# Altium project DM1090FFC_R3M0E3.PrjPcb (part 2 of 4)

## Sheet DM1090FFC_MIPI_CAM.SchDoc: =project_title
size Tabloid; PageSetup: Record=PageOptions|CenterHorizontal=True|CenterVertical=True|PrintScale=0.73|XCorrection=1.00|YCorrection=1.00|PrintKind=0|BorderSize=5000000|LeftOffset=0|BottomOffset=0|Orientation=2|PaperLength=1000|PaperWidth=1000|Scale=100|PaperSource=7|PrintQuality=-4|MediaType=1|DitherType=10|PaperKind=A4|PrintScaleMode=1; CompanyName: Luxonis Holding; DrawnBy: David Malovrh; Organization: Luxonis Holding; Address1: 1925 Harmony Park Drive; Address2: Westminster, CO; Address3: 80234; Address4: United States; DocumentNumber: DXXXX; Revision: R3M0E3; SheetNumber: 4; SheetTotal: 5
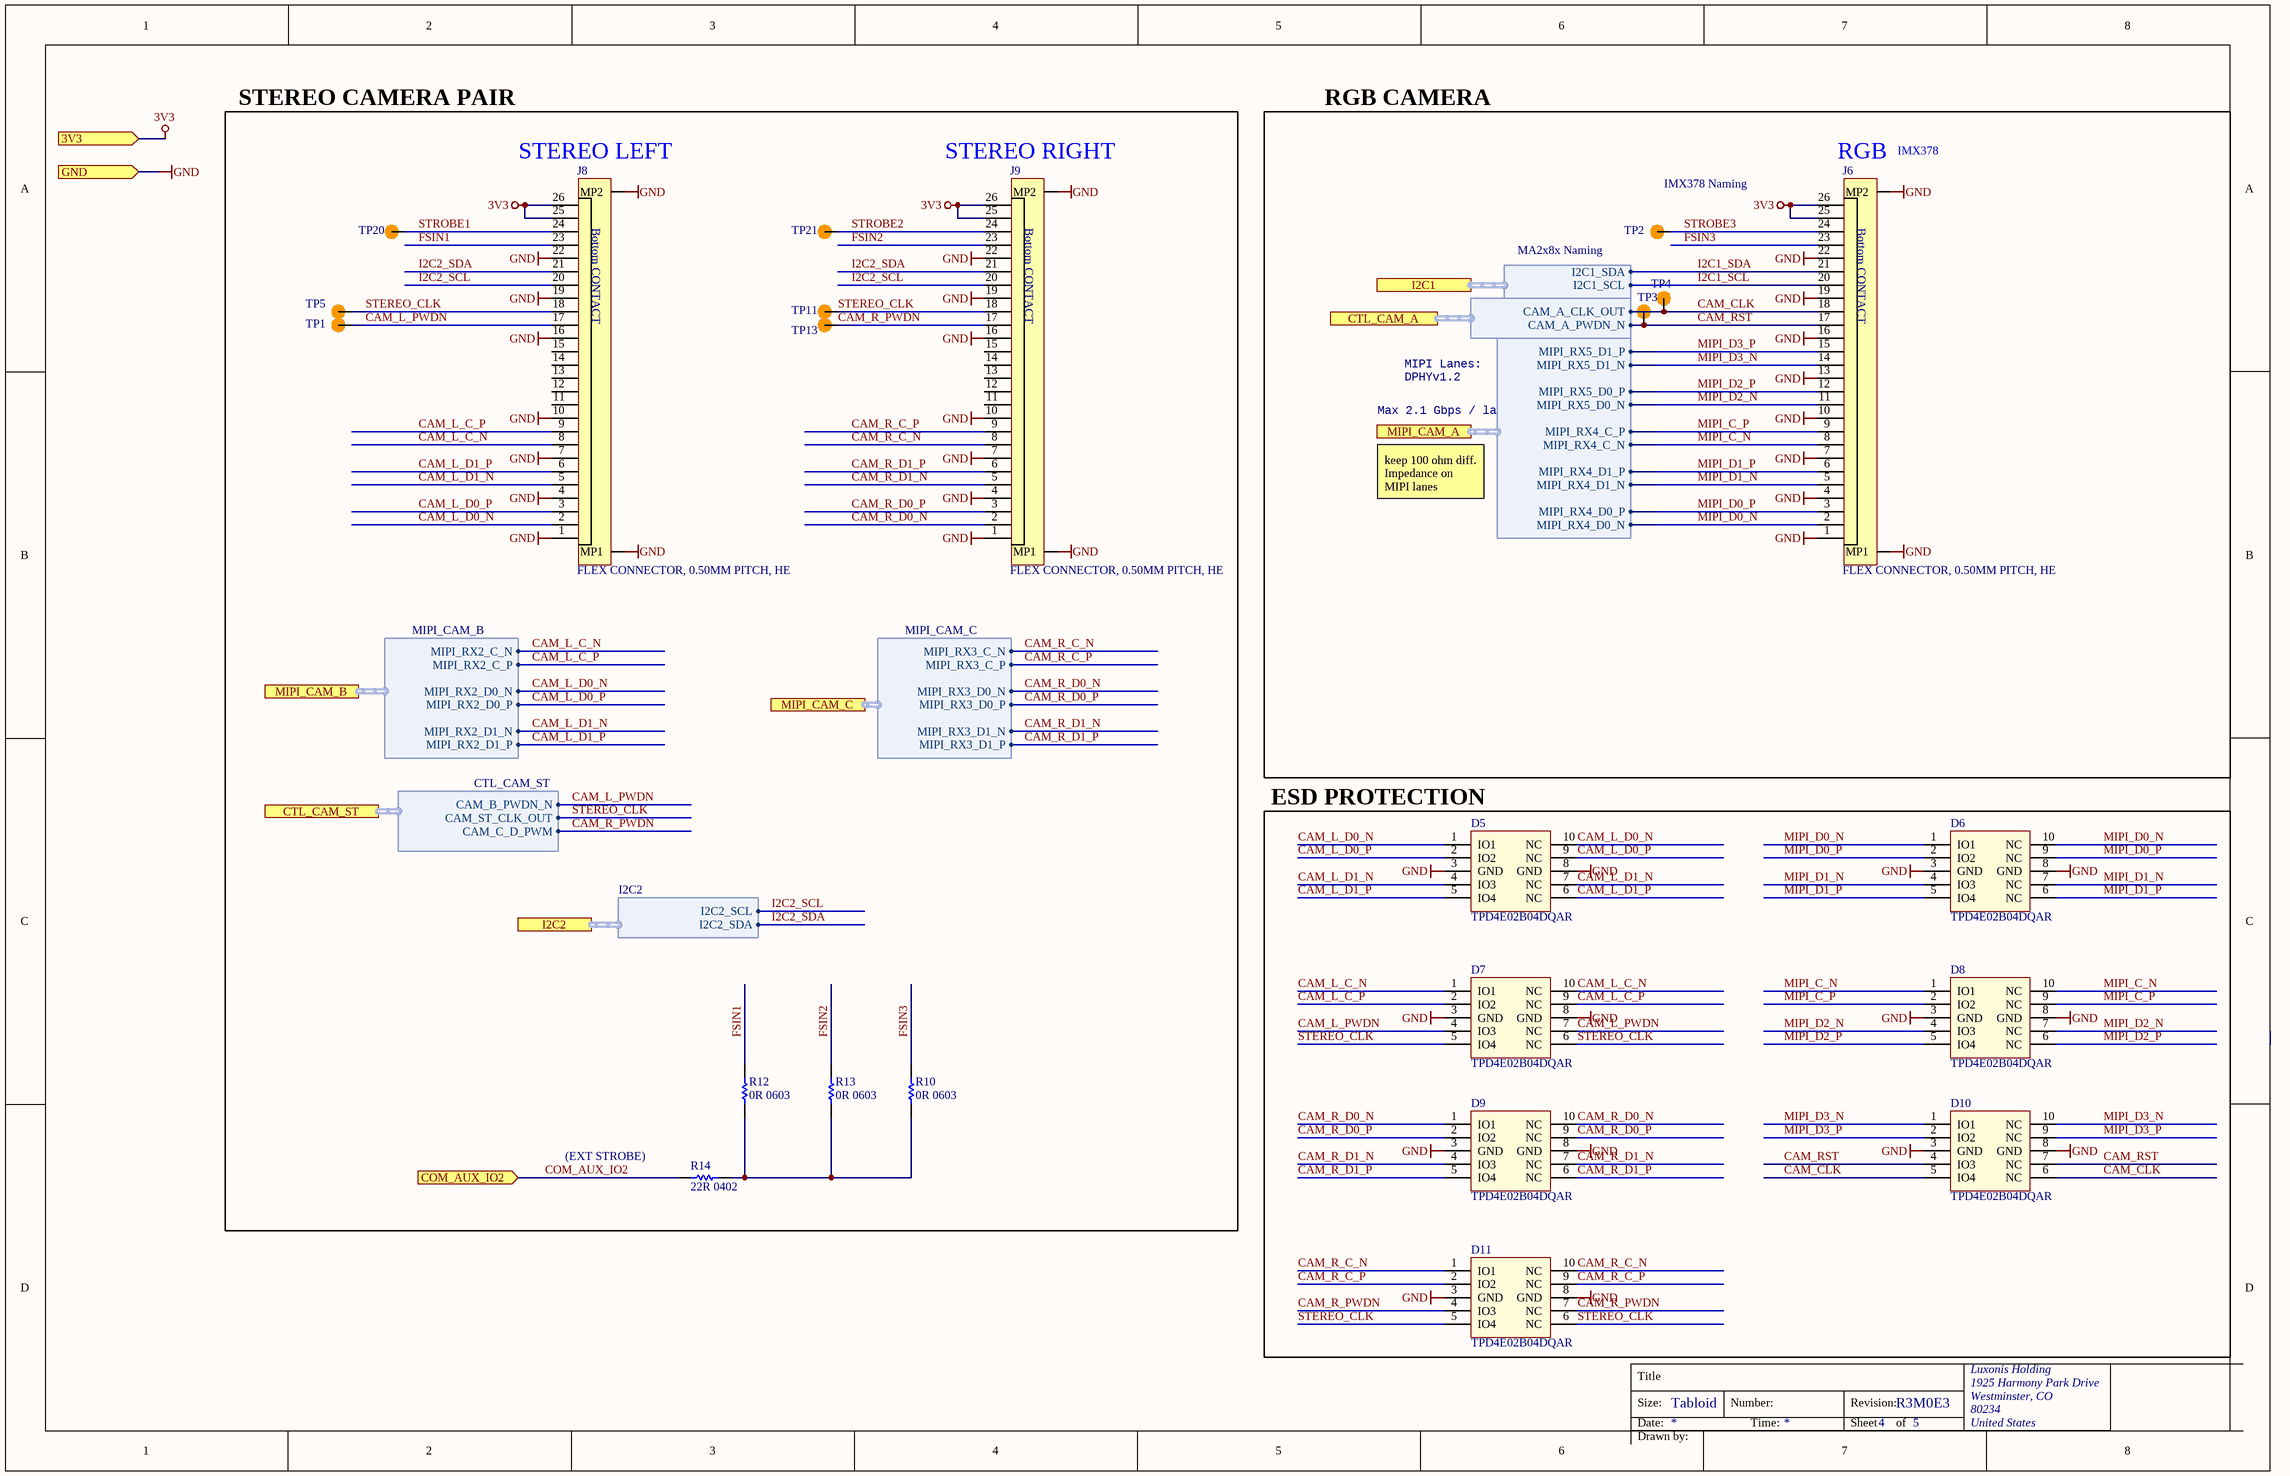
[diagram p3: DM1090FFC_MIPI_CAM.SchDoc]

### Parts
D5  TPD4E02B04DQAR  [TPD4E02B04DQAR]
D6  TPD4E02B04DQAR  [TPD4E02B04DQAR]
D7  TPD4E02B04DQAR  [TPD4E02B04DQAR]
D8  TPD4E02B04DQAR  [TPD4E02B04DQAR]
D9  TPD4E02B04DQAR  [TPD4E02B04DQAR]
D10  TPD4E02B04DQAR  [TPD4E02B04DQAR]
D11  TPD4E02B04DQAR  [TPD4E02B04DQAR]
J6  FLEX CONNECTOR, 0.50MM PITCH, HE  [F32R-1A7H1-11026]
J8  FLEX CONNECTOR, 0.50MM PITCH, HE  [F32R-1A7H1-11026]
J9  FLEX CONNECTOR, 0.50MM PITCH, HE  [F32R-1A7H1-11026]
R10  0R 0603  [RESC0603(1608)_N]
R12  0R 0603  [RESC0603(1608)_N]
R13  0R 0603  [RESC0603(1608)_N]
R14  22R 0402  [RESC0402(1005)_N]
TP1  TP100_200_NS  [TP100_200_NS]  (value not drawn)  (no BOM)
TP2  TP100_200_NS  [TP100_200_NS]  (value not drawn)  (no BOM)
TP3  TP100_200_NS  [TP100_200_NS]  (value not drawn)  (no BOM)
TP4  TP100_200_NS  [TP100_200_NS]  (value not drawn)  (no BOM)
TP5  TP100_200_NS  [TP100_200_NS]  (value not drawn)  (no BOM)
TP11  TP100_200_NS  [TP100_200_NS]  (value not drawn)  (no BOM)
TP13  TP100_200_NS  [TP100_200_NS]  (value not drawn)  (no BOM)
TP20  TP100_200_NS  [TP100_200_NS]  (value not drawn)  (no BOM)
TP21  TP100_200_NS  [TP100_200_NS]  (value not drawn)  (no BOM)

### Blocks framed on the sheet
ESD PROTECTION: D5-D11

### Ports
3V3 (in), COM_AUX_IO2 (in), CTL_CAM_A (harness CTL_CAM_A), CTL_CAM_ST (harness CTL_CAM_ST), GND (in), I2C1 (harness I2C1), I2C2 (harness I2C2), MIPI_CAM_A (harness MIPI_CAM_A), MIPI_CAM_B (harness MIPI_CAM_B), MIPI_CAM_C (harness MIPI_CAM_C)

### Harnesses
MIPI_CAM_B: MIPI_RX2_C_P, MIPI_RX2_C_N, MIPI_RX2_D0_P, MIPI_RX2_D0_N, MIPI_RX2_D1_P, MIPI_RX2_D1_N
I2C2: I2C2_SDA, I2C2_SCL
I2C1: I2C1_SDA, I2C1_SCL
MIPI_CAM_A: MIPI_RX5_D0_P, MIPI_RX5_D0_N, MIPI_RX4_D0_P, MIPI_RX4_D0_N, MIPI_RX4_C_P, MIPI_RX4_C_N, MIPI_RX4_D1_N, MIPI_RX4_D1_P, MIPI_RX5_D1_P, MIPI_RX5_D1_N
MIPI_CAM_C: MIPI_RX3_C_P, MIPI_RX3_C_N, MIPI_RX3_D0_P, MIPI_RX3_D0_N, MIPI_RX3_D1_P, MIPI_RX3_D1_N
CTL_CAM_A: CAM_A_PWDN_N, CAM_A_CLK_OUT
CTL_CAM_ST: CAM_ST_CLK_OUT, CAM_B_PWDN_N, CAM_C_D_PWM

### Nets
3V3: J6.25 J6.26 J8.25 J8.26 J9.25 J9.26 ; port 3V3
GND: D5.3(GND) D5.8(GND) D6.3(GND) D6.8(GND) D7.3(GND) D7.8(GND) D8.3(GND) D8.8(GND) D9.3(GND) D9.8(GND) D10.3(GND) D10.8(GND) D11.3(GND) D11.8(GND) J6.1 J6.4 J6.7 J6.10 J6.13 J6.16 J6.19 J6.22 J6.MP1 J6.MP2 J8.1 J8.4 J8.7 J8.10 J8.16 J8.19 J8.22 J8.MP1 J8.MP2 J9.1 J9.4 J9.7 J9.10 J9.16 J9.19 J9.22 J9.MP1 J9.MP2 ; port GND
CAM_CLK: D10.5(IO4) D10.6(NC) J6.18 TP4.1 ; port CTL_CAM_A.CAM_A_CLK_OUT  [project net CAM_A_CLK_OUT]
CAM_L_C_N: D7.1(IO1) D7.10(NC) J8.8 ; port MIPI_CAM_B.MIPI_RX2_C_N
CAM_L_C_P: D7.2(IO2) D7.9(NC) J8.9 ; port MIPI_CAM_B.MIPI_RX2_C_P
CAM_L_D0_N: D5.1(IO1) D5.10(NC) J8.2 ; port MIPI_CAM_B.MIPI_RX2_D0_N
CAM_L_D0_P: D5.2(IO2) D5.9(NC) J8.3 ; port MIPI_CAM_B.MIPI_RX2_D0_P
CAM_L_D1_N: D5.4(IO3) D5.7(NC) J8.5 ; port MIPI_CAM_B.MIPI_RX2_D1_N
CAM_L_D1_P: D5.5(IO4) D5.6(NC) J8.6 ; port MIPI_CAM_B.MIPI_RX2_D1_P
CAM_L_PWDN: D7.4(IO3) D7.7(NC) J8.17 TP1.1 ; port CTL_CAM_ST.CAM_B_PWDN_N  [project net CAM_B_PWDN_N]
CAM_R_C_N: D11.1(IO1) D11.10(NC) J9.8 ; port MIPI_CAM_C.MIPI_RX3_C_N
CAM_R_C_P: D11.2(IO2) D11.9(NC) J9.9 ; port MIPI_CAM_C.MIPI_RX3_C_P
CAM_R_D0_N: D9.1(IO1) D9.10(NC) J9.2 ; port MIPI_CAM_C.MIPI_RX3_D0_N
CAM_R_D0_P: D9.2(IO2) D9.9(NC) J9.3 ; port MIPI_CAM_C.MIPI_RX3_D0_P
CAM_R_D1_N: D9.4(IO3) D9.7(NC) J9.5 ; port MIPI_CAM_C.MIPI_RX3_D1_N
CAM_R_D1_P: D9.5(IO4) D9.6(NC) J9.6 ; port MIPI_CAM_C.MIPI_RX3_D1_P
CAM_R_PWDN: D11.4(IO3) D11.7(NC) J9.17 TP13.1 ; port CTL_CAM_ST.CAM_C_D_PWM  [project net CAM_C_D_PWM]
CAM_RST: D10.4(IO3) D10.7(NC) J6.17 TP3.1 ; port CTL_CAM_A.CAM_A_PWDN_N  [project net CAM_A_PWDN_N]
COM_AUX_IO2: R14.1 ; port COM_AUX_IO2
FSIN1: J8.23 R12.2
FSIN2: J9.23 R13.2
FSIN3: J6.23 R10.2
I2C1_SCL: J6.20 ; port I2C1.I2C1_SCL
I2C1_SDA: J6.21 ; port I2C1.I2C1_SDA
I2C2_SCL: J8.20 J9.20 ; port I2C2.I2C2_SCL
I2C2_SDA: J8.21 J9.21 ; port I2C2.I2C2_SDA
MIPI_C_N: D8.1(IO1) D8.10(NC) J6.8 ; port MIPI_CAM_A.MIPI_RX4_C_N
MIPI_C_P: D8.2(IO2) D8.9(NC) J6.9 ; port MIPI_CAM_A.MIPI_RX4_C_P
MIPI_D0_N: D6.1(IO1) D6.10(NC) J6.2 ; port MIPI_CAM_A.MIPI_RX4_D0_N
MIPI_D0_P: D6.2(IO2) D6.9(NC) J6.3 ; port MIPI_CAM_A.MIPI_RX4_D0_P
MIPI_D1_N: D6.4(IO3) D6.7(NC) J6.5 ; port MIPI_CAM_A.MIPI_RX4_D1_N
MIPI_D1_P: D6.5(IO4) D6.6(NC) J6.6 ; port MIPI_CAM_A.MIPI_RX4_D1_P
MIPI_D2_N: D8.4(IO3) D8.7(NC) J6.11 ; port MIPI_CAM_A.MIPI_RX5_D0_N
MIPI_D2_P: D8.5(IO4) D8.6(NC) J6.12 ; port MIPI_CAM_A.MIPI_RX5_D0_P
MIPI_D3_N: D10.1(IO1) D10.10(NC) J6.14 ; port MIPI_CAM_A.MIPI_RX5_D1_N
MIPI_D3_P: D10.2(IO2) D10.9(NC) J6.15 ; port MIPI_CAM_A.MIPI_RX5_D1_P
STEREO_CLK: D7.5(IO4) D7.6(NC) D11.5(IO4) D11.6(NC) J8.18 J9.18 TP5.1 TP11.1 ; port CTL_CAM_ST.CAM_ST_CLK_OUT  [project net CAM_ST_CLK_OUT]
STROBE1: J8.24 TP20.1
STROBE2: J9.24 TP21.1
STROBE3: J6.24 TP2.1
NetR10_1: R10.1 R12.1 R13.1 R14.2

Not connected (* = marked no-connect by the designer): J8 11 12 13 14 15; J9 11 12 13 14 15

### Notes on the sheet
- STEREO CAMERA PAIR
- (near J8) STEREO LEFT
- (near J9) STEREO RIGHT
- RGB CAMERA
- (near J6) RGB
- (near J6) IMX378
- (near TP2) IMX378 Naming
- MA2x8x Naming
- Max 2.1 Gbps / lane
- MIPI Lanes:
- DPHYv1.2
- keep 100 ohm diff. Impedance on MIPI lanes
- (EXT STROBE)
- Title
- Size:
- Date:
- Tabloid
- Number:
- Time:
- Revision:
- Sheet
- of
- Drawn by:
- (in symbol F32R-1A7H1-11026) Bottom CONTACT

### Library data of the parts
D5-D11 = TPD4E02B04DQAR: TVS DIODE 3.6V 8.8V 10USON 8.8V (Typ) Clamp 5A (8/20µs) Ipp Tvs Diode Surface Mount 10-USON (2.5x1); Manufacturer 1: Texas Instruments; Number of Bidirectional Channels: 4; Min Breakdown Voltage: 5.5V; Peak Pulse Power: 17W; Power Line Protection: No; Interface: USB,HDMI; Supplier 1: Digi-Key; Manufacturer Part Number 1: TPD4E02B04DQAR; Stock 1: 25615; Pricing 1: 1=0.69000, 10=0.60800, 100=0.46650, 500=0.36874, 1000=0.29499 (USD); RoHS: Yes; Mount: Surface Mount; Number of Pins: 10; Min Operating Temperature: -40°C; Max Operating Temperature: 125°C; Packaging: Cut Tape; Reverse Standoff Voltage: 3.6V; Clamping Voltage: 8.8V; Operating Supply Voltage: 3.6V; Peak Pulse Current: 5A; Number of Channels: 4; Composition: Zener; REACH SVHC: No SVHC; Lead Free: Lead Free; ComponentLink1URL: http://www.ti.com/general/docs/lit/getliterature.tsp?genericPartNumber=TPD4E02B04&amp;&amp;fileType=pdf&src-supplier=Element14; ComponentLink1Description: http://www.ti.com/general/docs/lit/getliterature.tsp?genericPartNumber=TPD4E02B04&amp;&amp;fileType=pdf&src-supplier=Element14; ComponentLink2URL: http://www.ti.com/lit/ds/symlink/tpd4e02b04.pdf?src-supplier=Farnell; ComponentLink2Description: http://www.ti.com/lit/ds/symlink/tpd4e02b04.pdf?src-supplier=Farnell; ComponentLink3URL: http://www.ti.com/lit/ds/symlink/tpd4e02b04.pdf?src-supplier=Newark; ComponentLink3Description: http://www.ti.com/lit/ds/symlink/tpd4e02b04.pdf?src-supplier=Newark; ComponentLink4URL: http://www.ti.com/lit/ds/symlink/tpd4e02b04.pdf?src-supplier=Digi-Key; ComponentLink4Description: http://www.ti.com/lit/ds/symlink/tpd4e02b04.pdf?src-supplier=Digi-Key; Supplier Part Number 1: 296-43875-1-ND
J6 J8 J9 = F32R-1A7H1-11026: 26 Position FFC, FPC Connector Contacts, Bottom 0.020" (0.50mm) Surface Mount, Right Angle; Manufacturer 1: Amphenol ICC (FCI); Number of Positions: 26; Voltage Rating: 50V; Current Rating: 500mA; Pitch: 0.02inch; Supplier 1: Digi-Key; Manufacturer Part Number 1: F32R-1A7H1-11026; RoHS: Yes; Category: Connectors; Pricing 1: 1=0.77, 10=0.721, 100=0.5529, 500=0.4808 (USD); Mount: Surface Mount; Contact Plating: Tin; Contact Material: Bronze; Min Operating Temperature: -40°C; Max Operating Temperature: 105°C; Packaging: Tape and Reel; Termination: Solder; Flammability Rating: UL94 V-0; ComponentLink1URL: https://cdn.amphenol-icc.com/media/wysiwyg/files/drawing/f32r-f32j.pdf; ComponentLink1Description: https://cdn.amphenol-icc.com/media/wysiwyg/files/drawing/f32r-f32j.pdf; Stock 1: 1709; Supplier Part Number 1: 609-F32R-1A7H1-11026CT-ND
R10 R12 R13 = CRCW06030000Z0EA: RES SMD 0 OHM JUMPER 1/10W 0603 0 Ohms Jumper 0.1W, 1/10W Chip Resistor 0603 (1608 Metric) Automotive AEC-Q200 Thick Film; Manufacturer 1: Vishay; Manufacturer Part Number 1: CRCW0603-0000Z0EA; Resistance: 0mR; Power Rating: 100mW; Voltage Rating: 75V; Temperature Coefficient: 100ppm/°C; Tolerance: 5%; Current Rating: 2A; Supplier 1: Digi-Key; Stock 1: 742743; Pricing 1: 1=0.100000, 10=0.034000, 25=0.024400, 50=0.018600, 100=0.013800, 250=0.010480, 500=0.008400, 1000=0.006180 (USD); RoHS: Yes; Mount: Surface Mount; Case/Package: 0603; Weight: 7.1E-05oz; Contact Plating: Tin,Lead; Case Code (Metric): 1608; Case Code (Imperial): 0603; Min Operating Temperature: -55°C; Max Operating Temperature: 155°C; Composition: Thick Film; Termination: SMD/SMT; Packaging: Tape and Reel; Package Quantity: 1; Number of Terminations: 2; Military Standard: Not; Max Power Dissipation: 100mW; Voltage Rating (DC): 75V; Features: Automotive AEC-Q200; Working Voltage: 75V; Length: 1.55mm; Height: 0.02inch; Width: 0.033inch; Depth: 0.85mm; Radiation Hardening: No; Lead Free: Lead Free; REACH SVHC: Unknown; ComponentLink1URL: https://datasheet.ciiva.com/2461/dcrcwe3-2461968.pdf?src-supplier=Digi-Key; ComponentLink1Description: https://datasheet.ciiva.com/2461/dcrcwe3-2461968.pdf?src-supplier=Digi-Key; ComponentLink2URL: https://datasheet.ciiva.com/2461/dcrcwe3-2461969.pdf?src-supplier=Digi-Key; ComponentLink2Description: https://datasheet.ciiva.com/2461/dcrcwe3-2461969.pdf?src-supplier=Digi-Key; ComponentLink3URL: https://datasheet.ciiva.com/2461/dcrcwe3-2461970.pdf?src-supplier=Digi-Key; ComponentLink3Description: https://datasheet.ciiva.com/2461/dcrcwe3-2461970.pdf?src-supplier=Digi-Key; ComponentLink4URL: https://datasheet.ciiva.com/8340/dcrcwe3-8340197.pdf?src-supplier=Avnet; ComponentLink4Description: https://datasheet.ciiva.com/8340/dcrcwe3-8340197.pdf?src-supplier=Avnet; ComponentLink5URL: https://datasheet.ciiva.com/16941/dcrcw-16941302.pdf?src-supplier=Avnet+Europe; ComponentLink5Description: https://datasheet.ciiva.com/16941/dcrcw-16941302.pdf?src-supplier=Avnet+Europe; ComponentLink6URL: https://datasheet.ciiva.com/16199/dcrcwe3-16199063.pdf?src-supplier=Future+Electronics; ComponentLink6Description: https://datasheet.ciiva.com/16199/dcrcwe3-16199063.pdf?src-supplier=Future+Electronics; ComponentLink7URL: https://datasheet.ciiva.com/16725/70201119-16725175.pdf?src-supplier=Allied+Electronics; ComponentLink7Description: https://datasheet.ciiva.com/16725/70201119-16725175.pdf?src-supplier=Allied+Electronics; ComponentLink8URL: https://datasheet.ciiva.com/26316/fld-crcw-e3-data-en-26316615.pdf?src-supplier=Distrelec; ComponentLink8Description: https://datasheet.ciiva.com/26316/fld-crcw-e3-data-en-26316615.pdf?src-supplier=Distrelec; ComponentLink9URL: https://datasheet.ciiva.com/5544/dcrcwe3-109170-5544344.pdf?src-supplier=Mouser; ComponentLink9Description: https://datasheet.ciiva.com/5544/dcrcwe3-109170-5544344.pdf?src-supplier=Mouser; ComponentLink10URL: https://datasheet.ciiva.com/7841/1720486-7841816.pdf?src-supplier=Element14; ComponentLink10Description: https://datasheet.ciiva.com/7841/1720486-7841816.pdf?src-supplier=Element14; ComponentLink11URL: https://datasheet.ciiva.com/7841/1720486-7841817.pdf?src-supplier=Element14; ComponentLink11Description: https://datasheet.ciiva.com/7841/1720486-7841817.pdf?src-supplier=Element14; ComponentLink12URL: https://datasheet.ciiva.com/7841/125364-7841818.pdf?src-supplier=Element14; ComponentLink12Description: https://datasheet.ciiva.com/7841/125364-7841818.pdf?src-supplier=Element14; ComponentLink13URL: https://datasheet.ciiva.com/16721/70201119-16721450.pdf?src-supplier=Allied+Electronics; ComponentLink13Description: https://datasheet.ciiva.com/16721/70201119-16721450.pdf?src-supplier=Allied+Electronics; Supplier Part Number 1: 541-0.0GCT-ND
R14 = RC0402FR-0722RL: RES SMD 22 OHM 1% 1/16W 0402; Manufacturer 1: Yageo; Additional Feature: LASER TRIMMABLE; Rated Power Dissipation (P): 62.5mW; Rated Temperature: 70°C; Temperature Coefficient: 100ppm/°C; Working Voltage: 50V; Package Height: 0.35mm; Package Length: 1mm; Package Width: 0.5mm; Supplier 1: RSComponents; Manufacturer Part Number 1: RC0402FR-0722RL; RoHS: Yes; Category: Chip SMD Resistors; Stock 1: 4700; Pricing 1: 10000=0,00200, 50000=0,00200, 100000=0,00200, 200000=0,00200, 400000=0,00200 (GBP); Mount: Surface Mount; Number of Pins: 2; Package Shape: Rectangular; Size Code: 0402; Terminal Finish: Nickel; Min Operating Temperature: -55°C; Max Operating Temperature: 155°C; Tolerance: 1%; JESD-609 Code: e3; Resistor Type: FIXED RESISTOR; Packaging: Tape and Reel; Resistance: 22R; Technology: METAL GLAZE/THICK FILM; Termination: Wraparound; Construction: Chip; Package Style: SMTMeter; REACH SVHC: Yes; RoHS Compliant: Yes; ComponentLink1URL: https://datasheet.ciiva.com:443/pdfs/VipMasterIC/IC/YAGO/YAGO-S-A0008145938/YAGO-S-A0008145938-1.pdf?src-supplier=IHS+Markit; ComponentLink1Description: https://datasheet.ciiva.com:443/pdfs/VipMasterIC/IC/YAGO/YAGO-S-A0008145938/YAGO-S-A0008145938-1.pdf?src-supplier=IHS+Markit; ComponentLink2URL: https://datasheet.ciiva.com/11819/0900766b80c66297-11819462.pdf?src-supplier=RSComponents; ComponentLink2Description: https://datasheet.ciiva.com/11819/0900766b80c66297-11819462.pdf?src-supplier=RSComponents; ComponentLink3URL: https://datasheet.ciiva.com/16930/pyu-rc0402-51-rohs-l-6-r-16930687.pdf?src-supplier=Future+Electronics; ComponentLink3Description: https://datasheet.ciiva.com/16930/pyu-rc0402-51-rohs-l-6-r-16930687.pdf?src-supplier=Future+Electronics; ComponentLink4URL: https://datasheet.ciiva.com/7849/1018594-7849911.pdf?src-supplier=Element14; ComponentLink4Description: https://datasheet.ciiva.com/7849/1018594-7849911.pdf?src-supplier=Element14; ComponentLink5URL: https://datasheet.ciiva.com/26829/getdatasheetpartid-554995-26829991.pdf?src-supplier=Verical; ComponentLink5Description: https://datasheet.ciiva.com/26829/getdatasheetpartid-554995-26829991.pdf?src-supplier=Verical; ComponentLink6URL: https://datasheet.ciiva.com/7849/1018594-7849912.pdf?src-supplier=Element14; ComponentLink6Description: https://datasheet.ciiva.com/7849/1018594-7849912.pdf?src-supplier=Element14; Supplier Part Number 1: 1987710
TP1-TP5 TP11 TP13 TP20 TP21 = TEST_POINT

## Sheet Project_Information.SchDoc: =project_title
size Tabloid; CompanyName: Luxonis Holding; DrawnBy: David Malovrh; Organization: Luxonis Holding; Address1: 1925 Harmony Park Drive; Address2: Westminster, CO; Address3: 80234; Address4: United States; DocumentNumber: DXXXX; Revision: R3M0E3; SheetNumber: 1; SheetTotal: 5
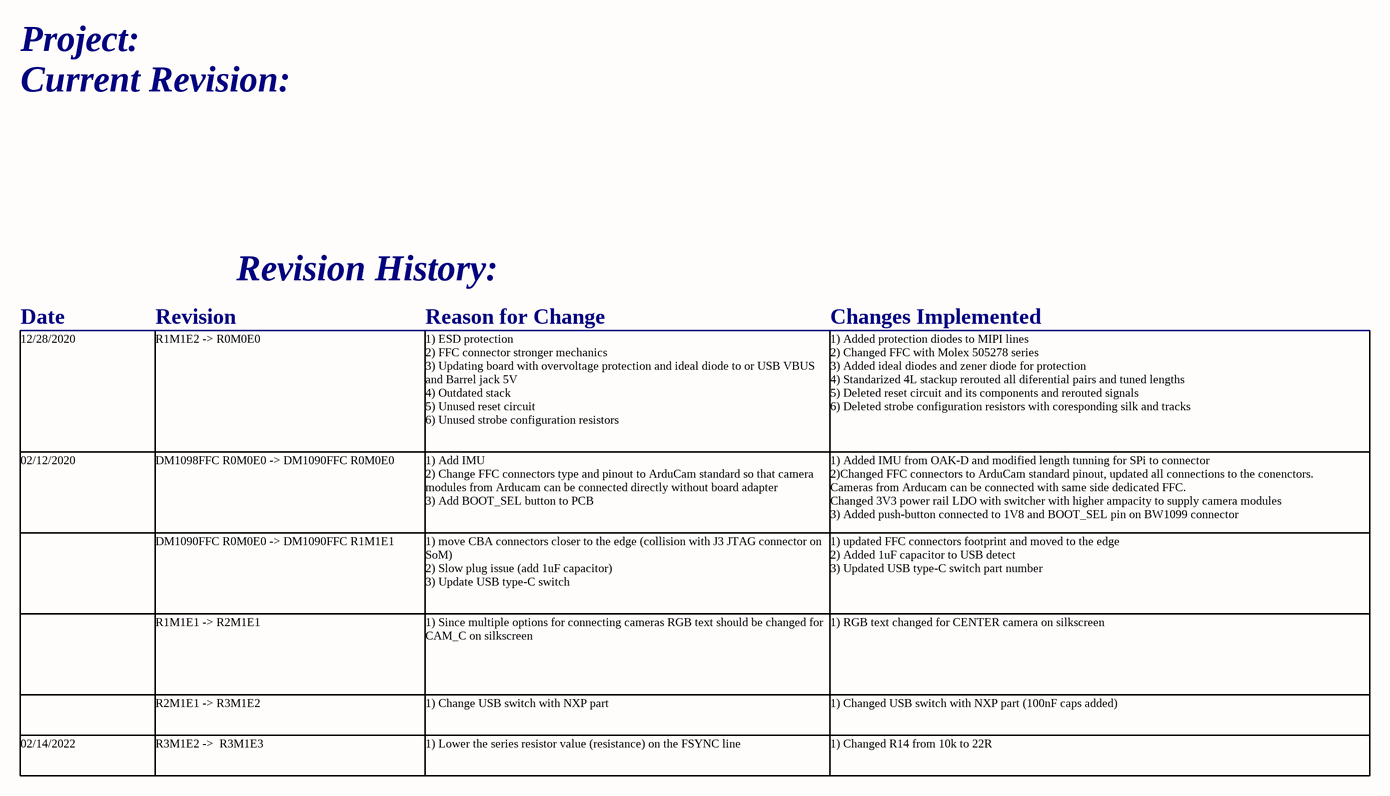
[diagram p4: Project_Information.SchDoc]

### Notes on the sheet
- Project:
- Current Revision:
- Revision History:
- Date
- Revision
- Reason for Change
- Changes Implemented
- 12/28/2020
- R1M1E2 -> R0M0E0
- 1) ESD protection
  2) FFC connector stronger mechanics
  3) Updating board with overvoltage protection and ideal diode to or USB VBUS and Barrel jack 5V
  4) Outdated stack
  5) Unused reset circuit
  6) Unused strobe configuration resistors
- 1) Added protection diodes to MIPI lines
  2) Changed FFC with Molex 505278 series
  3) Added ideal diodes and zener diode for protection
  4) Standarized 4L stackup rerouted all diferential pairs and tuned lengths
  5) Deleted reset circuit and its components and rerouted signals
  6) Deleted strobe configuration resistors with coresponding silk and tracks
- 02/12/2020
- DM1098FFC R0M0E0 -> DM1090FFC R0M0E0
- 1) Add IMU
  2) Change FFC connectors type and pinout to ArduCam standard so that camera modules from Arducam can be connected directly without board adapter
  3) Add BOOT_SEL button to PCB
- 1) Added IMU from OAK-D and modified length tunning for SPi to connector
  2)Changed FFC connectors to ArduCam standard pinout, updated all connections to the conenctors.
  Cameras from Arducam can be connected with same side dedicated FFC.
  Changed 3V3 power rail LDO with switcher with higher ampacity to supply camera modules
  3) Added push-button connected to 1V8 and BOOT_SEL pin on BW1099 connector
- DM1090FFC R0M0E0 -> DM1090FFC R1M1E1
- 1) move CBA connectors closer to the edge (collision with J3 JTAG connector on SoM)
  2) Slow plug issue (add 1uF capacitor)
  3) Update USB type-C switch
- 1) updated FFC connectors footprint and moved to the edge
  2) Added 1uF capacitor to USB detect
  3) Updated USB type-C switch part number
- R1M1E1 -> R2M1E1
- 1) Since multiple options for connecting cameras RGB text should be changed for CAM_C on silkscreen
- 1) RGB text changed for CENTER camera on silkscreen
- 02/14/2022
- R2M1E1 -> R3M1E2
- R3M1E2 ->  R3M1E3
- 1) Change USB switch with NXP part
- 1) Lower the series resistor value (resistance) on the FSYNC line
- 1) Changed USB switch with NXP part (100nF caps added)
- 1) Changed R14 from 10k to 22R
- Title
- Size:
- Date:
- Tabloid
- Number:
- Time:
- Revision:
- Sheet
- of
- Drawn by: